# Altium schematic sheet ZYNQ_Power.SchDoc
size A3; DocumentNumber: 11; SheetNumber: 11; SheetTotal: 47
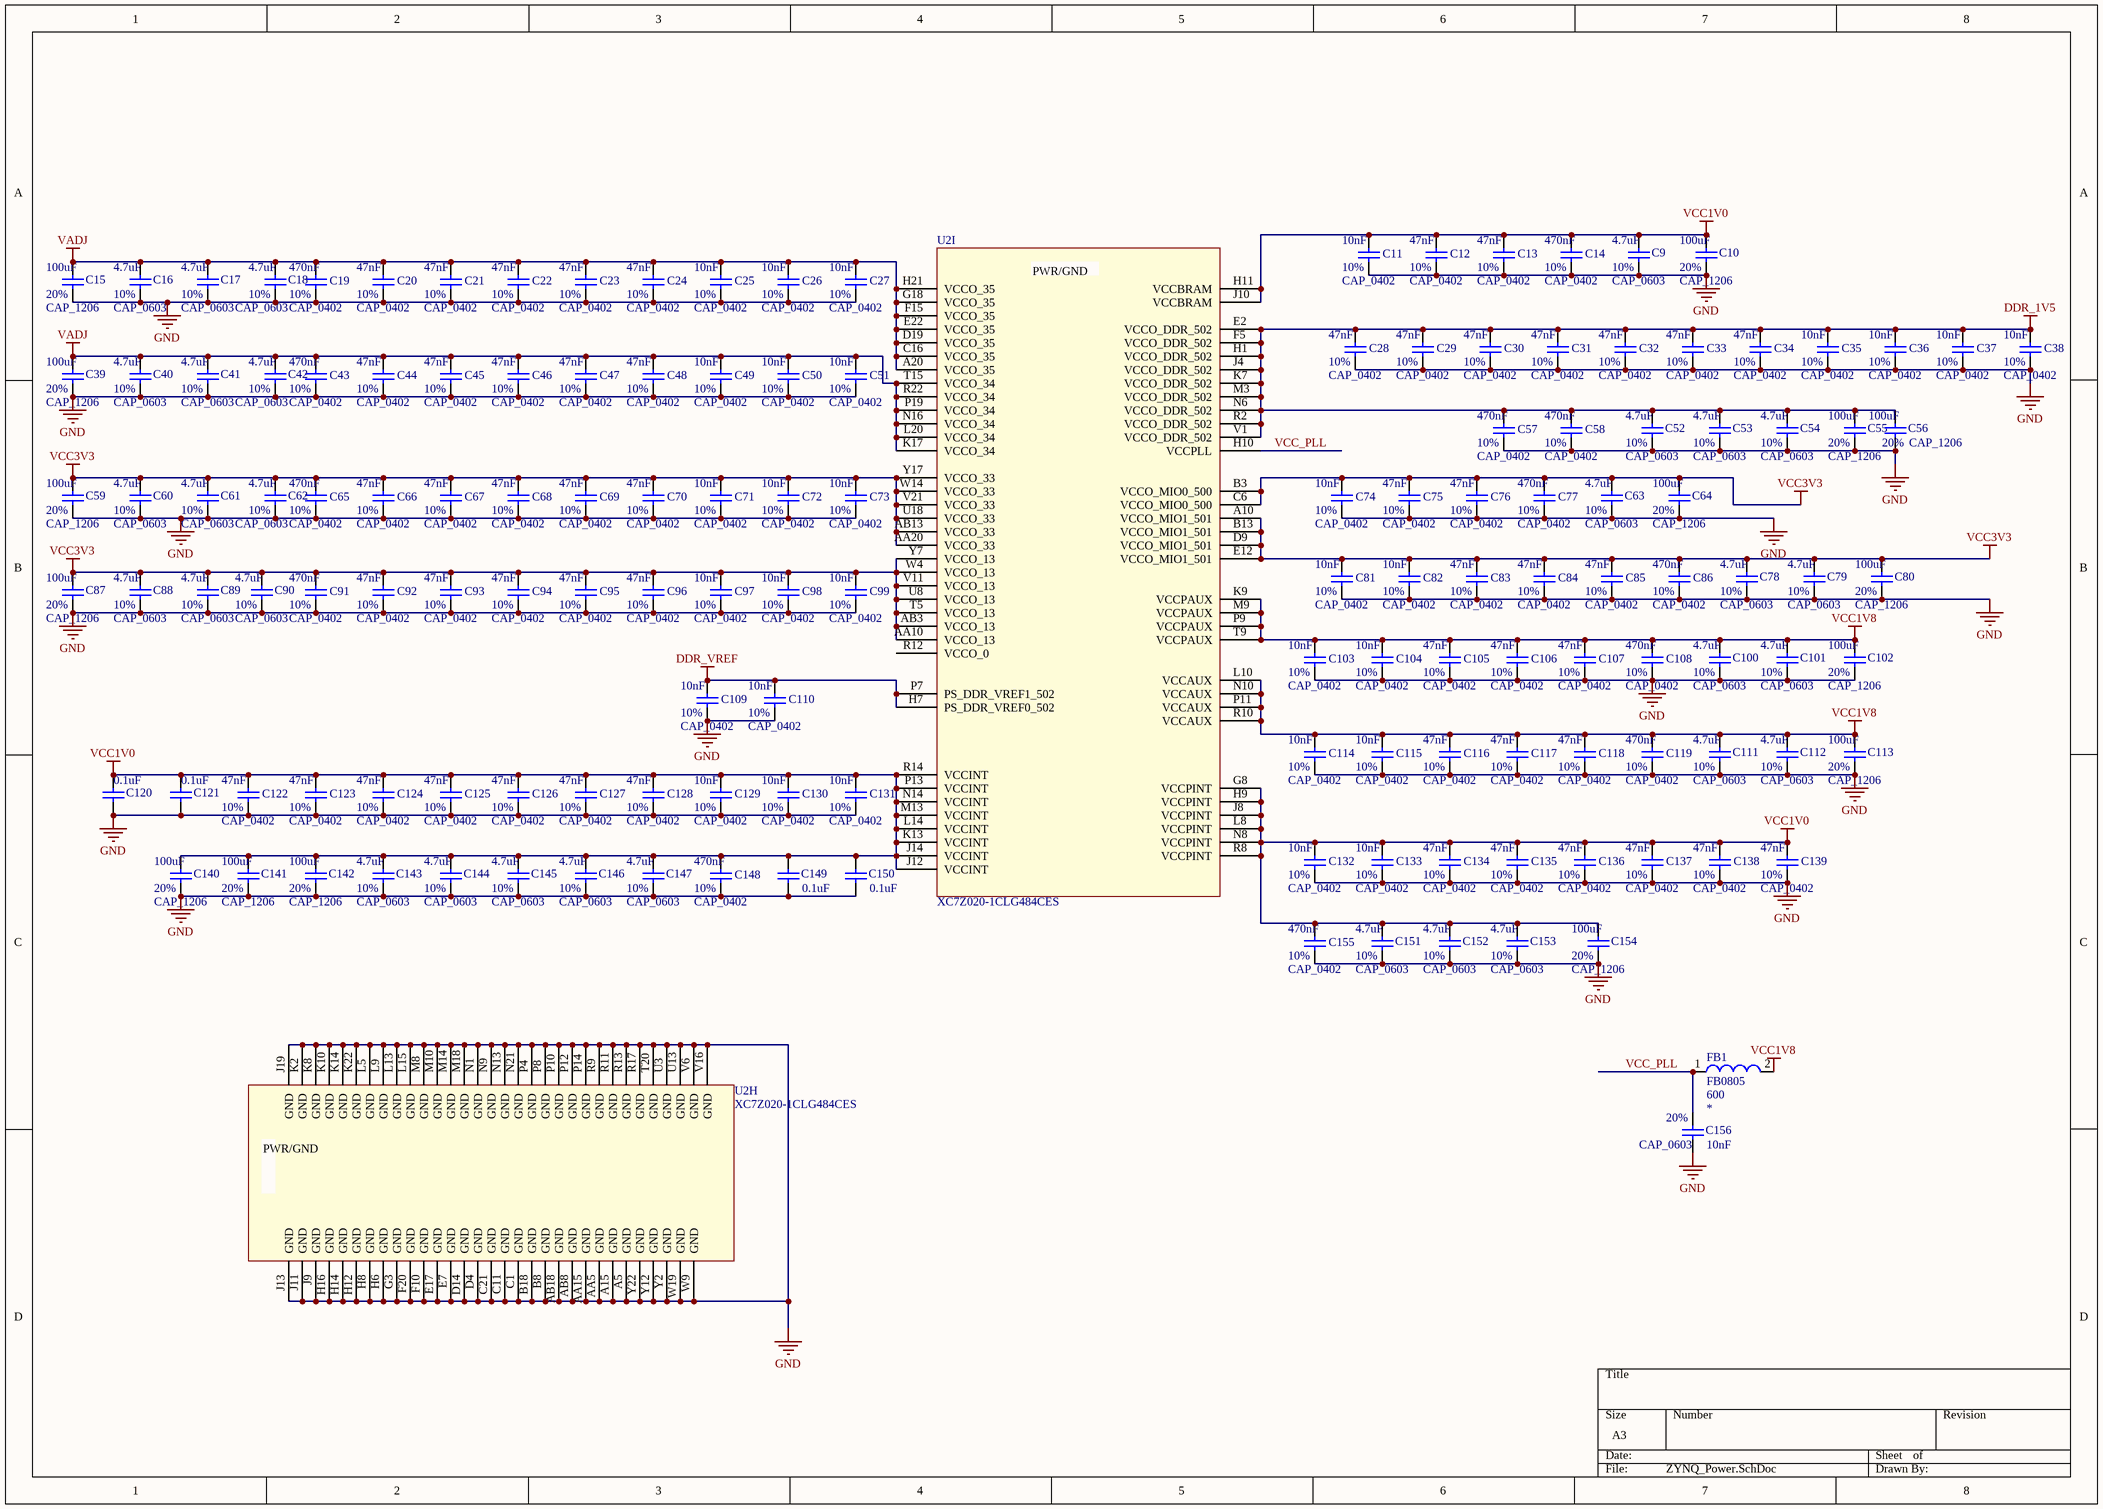
[diagram p0: ZYNQ_Power.SchDoc]

## Parts
C9  CAP_0603  value 4.7uF  Tolerance: 10%  [CAPC0603(1608)100_N]
C10  CAP_1206  value 100uF  Tolerance: 20%  [CAPC1206(3216)100_N]
C11  CAP_0402  value 10nF  Tolerance: 10%  [CAPC0402(1005)60_N]
C12  CAP_0402  value 47nF  Tolerance: 10%  [CAPC0402(1005)60_N]
C13  CAP_0402  value 47nF  Tolerance: 10%  [CAPC0402(1005)60_N]
C14  CAP_0402  value 470nF  Tolerance: 10%  [CAPC0402(1005)60_N]
C15  CAP_1206  value 100uF  Tolerance: 20%  [CAPC1206(3216)100_N]
C16  CAP_0603  value 4.7uF  Tolerance: 10%  [CAPC0603(1608)100_N]
C17  CAP_0603  value 4.7uF  Tolerance: 10%  [CAPC0603(1608)100_N]
C18  CAP_0603  value 4.7uF  Tolerance: 10%  [CAPC0603(1608)100_N]
C19  CAP_0402  value 470nF  Tolerance: 10%  [CAPC0402(1005)60_N]
C20  CAP_0402  value 47nF  Tolerance: 10%  [CAPC0402(1005)60_N]
C21  CAP_0402  value 47nF  Tolerance: 10%  [CAPC0402(1005)60_N]
C22  CAP_0402  value 47nF  Tolerance: 10%  [CAPC0402(1005)60_N]
C23  CAP_0402  value 47nF  Tolerance: 10%  [CAPC0402(1005)60_N]
C24  CAP_0402  value 47nF  Tolerance: 10%  [CAPC0402(1005)60_N]
C25  CAP_0402  value 10nF  Tolerance: 10%  [CAPC0402(1005)60_N]
C26  CAP_0402  value 10nF  Tolerance: 10%  [CAPC0402(1005)60_N]
C27  CAP_0402  value 10nF  Tolerance: 10%  [CAPC0402(1005)60_N]
C28  CAP_0402  value 47nF  Tolerance: 10%  [CAPC0402(1005)60_N]
C29  CAP_0402  value 47nF  Tolerance: 10%  [CAPC0402(1005)60_N]
C30  CAP_0402  value 47nF  Tolerance: 10%  [CAPC0402(1005)60_N]
C31  CAP_0402  value 47nF  Tolerance: 10%  [CAPC0402(1005)60_N]
C32  CAP_0402  value 47nF  Tolerance: 10%  [CAPC0402(1005)60_N]
C33  CAP_0402  value 47nF  Tolerance: 10%  [CAPC0402(1005)60_N]
C34  CAP_0402  value 47nF  Tolerance: 10%  [CAPC0402(1005)60_N]
C35  CAP_0402  value 10nF  Tolerance: 10%  [CAPC0402(1005)60_N]
C36  CAP_0402  value 10nF  Tolerance: 10%  [CAPC0402(1005)60_N]
C37  CAP_0402  value 10nF  Tolerance: 10%  [CAPC0402(1005)60_N]
C38  CAP_0402  value 10nF  Tolerance: 10%  [CAPC0402(1005)60_N]
C39  CAP_1206  value 100uF  Tolerance: 20%  [CAPC1206(3216)100_N]
C40  CAP_0603  value 4.7uF  Tolerance: 10%  [CAPC0603(1608)100_N]
C41  CAP_0603  value 4.7uF  Tolerance: 10%  [CAPC0603(1608)100_N]
C42  CAP_0603  value 4.7uF  Tolerance: 10%  [CAPC0603(1608)100_N]
C43  CAP_0402  value 470nF  Tolerance: 10%  [CAPC0402(1005)60_N]
C44  CAP_0402  value 47nF  Tolerance: 10%  [CAPC0402(1005)60_N]
C45  CAP_0402  value 47nF  Tolerance: 10%  [CAPC0402(1005)60_N]
C46  CAP_0402  value 47nF  Tolerance: 10%  [CAPC0402(1005)60_N]
C47  CAP_0402  value 47nF  Tolerance: 10%  [CAPC0402(1005)60_N]
C48  CAP_0402  value 47nF  Tolerance: 10%  [CAPC0402(1005)60_N]
C49  CAP_0402  value 10nF  Tolerance: 10%  [CAPC0402(1005)60_N]
C50  CAP_0402  value 10nF  Tolerance: 10%  [CAPC0402(1005)60_N]
C51  CAP_0402  value 10nF  Tolerance: 10%  [CAPC0402(1005)60_N]
C52  CAP_0603  value 4.7uF  Tolerance: 10%  [CAPC0603(1608)100_N]
C53  CAP_0603  value 4.7uF  Tolerance: 10%  [CAPC0603(1608)100_N]
C54  CAP_0603  value 4.7uF  Tolerance: 10%  [CAPC0603(1608)100_N]
C55  CAP_1206  value 100uF  Tolerance: 20%  [CAPC1206(3216)100_N]
C56  CAP_1206  value 100uF  Tolerance: 20%  [CAPC1206(3216)100_N]
C57  CAP_0402  value 470nF  Tolerance: 10%  [CAPC0402(1005)60_N]
C58  CAP_0402  value 470nF  Tolerance: 10%  [CAPC0402(1005)60_N]
C59  CAP_1206  value 100uF  Tolerance: 20%  [CAPC1206(3216)100_N]
C60  CAP_0603  value 4.7uF  Tolerance: 10%  [CAPC0603(1608)100_N]
C61  CAP_0603  value 4.7uF  Tolerance: 10%  [CAPC0603(1608)100_N]
C62  CAP_0603  value 4.7uF  Tolerance: 10%  [CAPC0603(1608)100_N]
C63  CAP_0603  value 4.7uF  Tolerance: 10%  [CAPC0603(1608)100_N]
C64  CAP_1206  value 100uF  Tolerance: 20%  [CAPC1206(3216)100_N]
C65  CAP_0402  value 470nF  Tolerance: 10%  [CAPC0402(1005)60_N]
C66  CAP_0402  value 47nF  Tolerance: 10%  [CAPC0402(1005)60_N]
C67  CAP_0402  value 47nF  Tolerance: 10%  [CAPC0402(1005)60_N]
C68  CAP_0402  value 47nF  Tolerance: 10%  [CAPC0402(1005)60_N]
C69  CAP_0402  value 47nF  Tolerance: 10%  [CAPC0402(1005)60_N]
C70  CAP_0402  value 47nF  Tolerance: 10%  [CAPC0402(1005)60_N]
C71  CAP_0402  value 10nF  Tolerance: 10%  [CAPC0402(1005)60_N]
C72  CAP_0402  value 10nF  Tolerance: 10%  [CAPC0402(1005)60_N]
C73  CAP_0402  value 10nF  Tolerance: 10%  [CAPC0402(1005)60_N]
C74  CAP_0402  value 10nF  Tolerance: 10%  [CAPC0402(1005)60_N]
C75  CAP_0402  value 47nF  Tolerance: 10%  [CAPC0402(1005)60_N]
C76  CAP_0402  value 47nF  Tolerance: 10%  [CAPC0402(1005)60_N]
C77  CAP_0402  value 470nF  Tolerance: 10%  [CAPC0402(1005)60_N]
C78  CAP_0603  value 4.7uF  Tolerance: 10%  [CAPC0603(1608)100_N]
C79  CAP_0603  value 4.7uF  Tolerance: 10%  [CAPC0603(1608)100_N]
C80  CAP_1206  value 100uF  Tolerance: 20%  [CAPC1206(3216)100_N]
C81  CAP_0402  value 10nF  Tolerance: 10%  [CAPC0402(1005)60_N]
C82  CAP_0402  value 10nF  Tolerance: 10%  [CAPC0402(1005)60_N]
C83  CAP_0402  value 47nF  Tolerance: 10%  [CAPC0402(1005)60_N]
C84  CAP_0402  value 47nF  Tolerance: 10%  [CAPC0402(1005)60_N]
C85  CAP_0402  value 47nF  Tolerance: 10%  [CAPC0402(1005)60_N]
C86  CAP_0402  value 470nF  Tolerance: 10%  [CAPC0402(1005)60_N]
C87  CAP_1206  value 100uF  Tolerance: 20%  [CAPC1206(3216)100_N]
C88  CAP_0603  value 4.7uF  Tolerance: 10%  [CAPC0603(1608)100_N]
C89  CAP_0603  value 4.7uF  Tolerance: 10%  [CAPC0603(1608)100_N]
C90  CAP_0603  value 4.7uF  Tolerance: 10%  [CAPC0603(1608)100_N]
C91  CAP_0402  value 470nF  Tolerance: 10%  [CAPC0402(1005)60_N]
C92  CAP_0402  value 47nF  Tolerance: 10%  [CAPC0402(1005)60_N]
C93  CAP_0402  value 47nF  Tolerance: 10%  [CAPC0402(1005)60_N]
C94  CAP_0402  value 47nF  Tolerance: 10%  [CAPC0402(1005)60_N]
C95  CAP_0402  value 47nF  Tolerance: 10%  [CAPC0402(1005)60_N]
C96  CAP_0402  value 47nF  Tolerance: 10%  [CAPC0402(1005)60_N]
C97  CAP_0402  value 10nF  Tolerance: 10%  [CAPC0402(1005)60_N]
C98  CAP_0402  value 10nF  Tolerance: 10%  [CAPC0402(1005)60_N]
C99  CAP_0402  value 10nF  Tolerance: 10%  [CAPC0402(1005)60_N]
C100  CAP_0603  value 4.7uF  Tolerance: 10%  [CAPC0603(1608)100_N]
C101  CAP_0603  value 4.7uF  Tolerance: 10%  [CAPC0603(1608)100_N]
C102  CAP_1206  value 100uF  Tolerance: 20%  [CAPC1206(3216)100_N]
C103  CAP_0402  value 10nF  Tolerance: 10%  [CAPC0402(1005)60_N]
C104  CAP_0402  value 10nF  Tolerance: 10%  [CAPC0402(1005)60_N]
C105  CAP_0402  value 47nF  Tolerance: 10%  [CAPC0402(1005)60_N]
C106  CAP_0402  value 47nF  Tolerance: 10%  [CAPC0402(1005)60_N]
C107  CAP_0402  value 47nF  Tolerance: 10%  [CAPC0402(1005)60_N]
C108  CAP_0402  value 470nF  Tolerance: 10%  [CAPC0402(1005)60_N]
C109  CAP_0402  value 10nF  Tolerance: 10%  [CAPC0402(1005)60_N]
C110  CAP_0402  value 10nF  Tolerance: 10%  [CAPC0402(1005)60_N]
C111  CAP_0603  value 4.7uF  Tolerance: 10%  [CAPC0603(1608)100_N]
C112  CAP_0603  value 4.7uF  Tolerance: 10%  [CAPC0603(1608)100_N]
C113  CAP_1206  value 100uF  Tolerance: 20%  [CAPC1206(3216)100_N]
C114  CAP_0402  value 10nF  Tolerance: 10%  [CAPC0402(1005)60_N]
C115  CAP_0402  value 10nF  Tolerance: 10%  [CAPC0402(1005)60_N]
C116  CAP_0402  value 47nF  Tolerance: 10%  [CAPC0402(1005)60_N]
C117  CAP_0402  value 47nF  Tolerance: 10%  [CAPC0402(1005)60_N]
C118  CAP_0402  value 47nF  Tolerance: 10%  [CAPC0402(1005)60_N]
C119  CAP_0402  value 470nF  Tolerance: 10%  [CAPC0402(1005)60_N]
C120  value 0.1uF  [CAPC0402(1005)60_N]  (hidden comment: TMK105BJ104KV-F)
C121  value 0.1uF  [CAPC0402(1005)60_N]  (hidden comment: TMK105BJ104KV-F)
C122  CAP_0402  value 47nF  Tolerance: 10%  [CAPC0402(1005)60_N]
C123  CAP_0402  value 47nF  Tolerance: 10%  [CAPC0402(1005)60_N]
C124  CAP_0402  value 47nF  Tolerance: 10%  [CAPC0402(1005)60_N]
C125  CAP_0402  value 47nF  Tolerance: 10%  [CAPC0402(1005)60_N]
C126  CAP_0402  value 47nF  Tolerance: 10%  [CAPC0402(1005)60_N]
C127  CAP_0402  value 47nF  Tolerance: 10%  [CAPC0402(1005)60_N]
C128  CAP_0402  value 47nF  Tolerance: 10%  [CAPC0402(1005)60_N]
C129  CAP_0402  value 10nF  Tolerance: 10%  [CAPC0402(1005)60_N]
C130  CAP_0402  value 10nF  Tolerance: 10%  [CAPC0402(1005)60_N]
C131  CAP_0402  value 10nF  Tolerance: 10%  [CAPC0402(1005)60_N]
C132  CAP_0402  value 10nF  Tolerance: 10%  [CAPC0402(1005)60_N]
C133  CAP_0402  value 10nF  Tolerance: 10%  [CAPC0402(1005)60_N]
C134  CAP_0402  value 47nF  Tolerance: 10%  [CAPC0402(1005)60_N]
C135  CAP_0402  value 47nF  Tolerance: 10%  [CAPC0402(1005)60_N]
C136  CAP_0402  value 47nF  Tolerance: 10%  [CAPC0402(1005)60_N]
C137  CAP_0402  value 47nF  Tolerance: 10%  [CAPC0402(1005)60_N]
C138  CAP_0402  value 47nF  Tolerance: 10%  [CAPC0402(1005)60_N]
C139  CAP_0402  value 47nF  Tolerance: 10%  [CAPC0402(1005)60_N]
C140  CAP_1206  value 100uF  Tolerance: 20%  [CAPC1206(3216)100_N]
C141  CAP_1206  value 100uF  Tolerance: 20%  [CAPC1206(3216)100_N]
C142  CAP_1206  value 100uF  Tolerance: 20%  [CAPC1206(3216)100_N]
C143  CAP_0603  value 4.7uF  Tolerance: 10%  [CAPC0603(1608)100_N]
C144  CAP_0603  value 4.7uF  Tolerance: 10%  [CAPC0603(1608)100_N]
C145  CAP_0603  value 4.7uF  Tolerance: 10%  [CAPC0603(1608)100_N]
C146  CAP_0603  value 4.7uF  Tolerance: 10%  [CAPC0603(1608)100_N]
C147  CAP_0603  value 4.7uF  Tolerance: 10%  [CAPC0603(1608)100_N]
C148  CAP_0402  value 470nF  Tolerance: 10%  [CAPC0402(1005)60_N]
C149  value 0.1uF  [CAPC0402(1005)60_N]  (hidden comment: TMK105BJ104KV-F)
C150  value 0.1uF  [CAPC0402(1005)60_N]  (hidden comment: TMK105BJ104KV-F)
C151  CAP_0603  value 4.7uF  Tolerance: 10%  [CAPC0603(1608)100_N]
C152  CAP_0603  value 4.7uF  Tolerance: 10%  [CAPC0603(1608)100_N]
C153  CAP_0603  value 4.7uF  Tolerance: 10%  [CAPC0603(1608)100_N]
C154  CAP_1206  value 100uF  Tolerance: 20%  [CAPC1206(3216)100_N]
C155  CAP_0402  value 470nF  Tolerance: 10%  [CAPC0402(1005)60_N]
C156  CAP_0603  value 10nF  Tolerance: 20%  [CAPC0402(1005)60_N]
FB1  FB0805  Resistance: 600  [Inductor0805(2012)]
U2  XC7Z020-1CLG484CES  [ZYNQ_xc7z020clg484pkg_BGA-484]  (parts H,I of 10)

## Nets
DDR_1V5: C28.2 C29.2 C30.2 C31.2 C32.2 C33.2 C34.2 C35.2 C36.2 C37.2 C38.2 C52.2 C53.2 C54.2 C55.2 C56.2 C57.2 C58.2 U2.E2(VCCO_DDR_502) U2.F5(VCCO_DDR_502) U2.H1(VCCO_DDR_502) U2.J4(VCCO_DDR_502) U2.K7(VCCO_DDR_502) U2.M3(VCCO_DDR_502) U2.N6(VCCO_DDR_502) U2.R2(VCCO_DDR_502) U2.V1(VCCO_DDR_502)
DDR_VREF: C109.2 C110.2 U2.H7(PS_DDR_VREF0_502) U2.P7(PS_DDR_VREF1_502)
GND: C9.1 C10.1 C11.1 C12.1 C13.1 C14.1 C15.1 C16.1 C17.1 C18.1 C19.1 C20.1 C21.1 C22.1 C23.1 C24.1 C25.1 C26.1 C27.1 C28.1 C29.1 C30.1 C31.1 C32.1 C33.1 C34.1 C35.1 C36.1 C37.1 C38.1 C39.1 C40.1 C41.1 C42.1 C43.1 C44.1 C45.1 C46.1 C47.1 C48.1 C49.1 C50.1 C51.1 C52.1 C53.1 C54.1 C55.1 C56.1 C57.1 C58.1 C59.1 C60.1 C61.1 C62.1 C63.1 C64.1 C65.1 C66.1 C67.1 C68.1 C69.1 C70.1 C71.1 C72.1 C73.1 C74.1 C75.1 C76.1 C77.1 C78.1 C79.1 C80.1 C81.1 C82.1 C83.1 C84.1 C85.1 C86.1 C87.1 C88.1 C89.1 C90.1 C91.1 C92.1 C93.1 C94.1 C95.1 C96.1 C97.1 C98.1 C99.1 C100.1 C101.1 C102.1 C103.1 C104.1 C105.1 C106.1 C107.1 C108.1 C109.1 C110.1 C111.1 C112.1 C113.1 C114.1 C115.1 C116.1 C117.1 C118.1 C119.1 C120.1 C121.1 C122.1 C123.1 C124.1 C125.1 C126.1 C127.1 C128.1 C129.1 C130.1 C131.1 C132.1 C133.1 C134.1 C135.1 C136.1 C137.1 C138.1 C139.1 C140.1 C141.1 C142.1 C143.1 C144.1 C145.1 C146.1 C147.1 C148.1 C149.1 C150.1 C151.1 C152.1 C153.1 C154.1 C155.1 C156.1 U2.A5(GND) U2.A15(GND) U2.AA5(GND) U2.AA15(GND) U2.AB8(GND) U2.AB18(GND) U2.B8(GND) U2.B18(GND) U2.C1(GND) U2.C11(GND) U2.C21(GND) U2.D4(GND) U2.D14(GND) U2.E7(GND) U2.E17(GND) U2.F10(GND) U2.F20(GND) U2.G3(GND) U2.H6(GND) U2.H8(GND) U2.H12(GND) U2.H14(GND) U2.H16(GND) U2.J9(GND) U2.J11(GND) U2.J13(GND) U2.J19(GND) U2.K2(GND) U2.K8(GND) U2.K10(GND) U2.K14(GND) U2.K22(GND) U2.L5(GND) U2.L9(GND) U2.L13(GND) U2.L15(GND) U2.M8(GND) U2.M10(GND) U2.M14(GND) U2.M18(GND) U2.N1(GND) U2.N9(GND) U2.N13(GND) U2.N21(GND) U2.P4(GND) U2.P8(GND) U2.P10(GND) U2.P12(GND) U2.P14(GND) U2.R9(GND) U2.R11(GND) U2.R13(GND) U2.R17(GND) U2.T20(GND) U2.U3(GND) U2.U13(GND) U2.V6(GND) U2.V16(GND) U2.W9(GND) U2.W19(GND) U2.Y2(GND) U2.Y12(GND) U2.Y22(GND)
VADJ: C15.2 C16.2 C17.2 C18.2 C19.2 C20.2 C21.2 C22.2 C23.2 C24.2 C25.2 C26.2 C27.2 C39.2 C40.2 C41.2 C42.2 C43.2 C44.2 C45.2 C46.2 C47.2 C48.2 C49.2 C50.2 C51.2 U2.A20(VCCO_35) U2.C16(VCCO_35) U2.D19(VCCO_35) U2.E22(VCCO_35) U2.F15(VCCO_35) U2.G18(VCCO_35) U2.H21(VCCO_35) U2.K17(VCCO_34) U2.L20(VCCO_34) U2.N16(VCCO_34) U2.P19(VCCO_34) U2.R22(VCCO_34) U2.T15(VCCO_34)
VCC1V0: C9.2 C10.2 C11.2 C12.2 C13.2 C14.2 C120.2 C121.2 C122.2 C123.2 C124.2 C125.2 C126.2 C127.2 C128.2 C129.2 C130.2 C131.2 C132.2 C133.2 C134.2 C135.2 C136.2 C137.2 C138.2 C139.2 C140.2 C141.2 C142.2 C143.2 C144.2 C145.2 C146.2 C147.2 C148.2 C149.2 C150.2 C151.2 C152.2 C153.2 C154.2 C155.2 U2.G8(VCCPINT) U2.H9(VCCPINT) U2.H11(VCCBRAM) U2.J8(VCCPINT) U2.J10(VCCBRAM) U2.J12(VCCINT) U2.J14(VCCINT) U2.K13(VCCINT) U2.L8(VCCPINT) U2.L14(VCCINT) U2.M13(VCCINT) U2.N8(VCCPINT) U2.N14(VCCINT) U2.P13(VCCINT) U2.R8(VCCPINT) U2.R14(VCCINT)
VCC1V8: C100.2 C101.2 C102.2 C103.2 C104.2 C105.2 C106.2 C107.2 C108.2 C111.2 C112.2 C113.2 C114.2 C115.2 C116.2 C117.2 C118.2 C119.2 FB1.2 U2.K9(VCCPAUX) U2.L10(VCCAUX) U2.M9(VCCPAUX) U2.N10(VCCAUX) U2.P9(VCCPAUX) U2.P11(VCCAUX) U2.R10(VCCAUX) U2.T9(VCCPAUX)
VCC3V3: C59.2 C60.2 C61.2 C62.2 C63.2 C64.2 C65.2 C66.2 C67.2 C68.2 C69.2 C70.2 C71.2 C72.2 C73.2 C74.2 C75.2 C76.2 C77.2 C78.2 C79.2 C80.2 C81.2 C82.2 C83.2 C84.2 C85.2 C86.2 C87.2 C88.2 C89.2 C90.2 C91.2 C92.2 C93.2 C94.2 C95.2 C96.2 C97.2 C98.2 C99.2 U2.A10(VCCO_MIO1_501) U2.AA10(VCCO_13) U2.AA20(VCCO_33) U2.AB3(VCCO_13) U2.AB13(VCCO_33) U2.B3(VCCO_MIO0_500) U2.B13(VCCO_MIO1_501) U2.C6(VCCO_MIO0_500) U2.D9(VCCO_MIO1_501) U2.E12(VCCO_MIO1_501) U2.T5(VCCO_13) U2.U8(VCCO_13) U2.U18(VCCO_33) U2.V11(VCCO_13) U2.V21(VCCO_33) U2.W4(VCCO_13) U2.W14(VCCO_33) U2.Y7(VCCO_13) U2.Y17(VCCO_33)
VCC_PLL: C156.2 FB1.1 U2.H10(VCCPLL)

Not connected (* = marked no-connect by the designer): U2 R12(VCCO_0)

## Notes on the sheet
- (in symbol XC7Z020-1CLG484CES, part H) PWR/GND
- (in symbol XC7Z020-1CLG484CES, part I) PWR/GND

## Library data of the parts
C9 C16-C18 C40-C42 C52-C54 C60-C63 C78 C79 C88-C90 C100 C101 C111 C112 C143-C147 C151-C153 = CAP_0603: 4.7uF, ceramic, 10% 6.3V X5R Low ESR, 0603; Part Number: GRM188R60J475KE19D; Manufacturer: Murata Electronics North America; Footprint Ref: CAPC0603(1608)100_N; Library Ref: CAP_0603
C10 C15 C39 C55 C56 C59 C64 C80 C87 C102 C113 C140-C142 C154 = CAP_1206: CAP CER 100UF 6.3V 20% X5R 1206; Part Number: JMK316BJ107ML-T; Manufacturer: Taiyo Yuden; Footprint Ref: CAPC1206(3216)100_N; Library Ref: CAP_1206; Distributor: http://www.yuden.co.jp/productdata/catalog/en/mlcc01_e.pdf
C11 C25-C27 C35-C38 C49-C51 C71-C74 C81 C82 C97-C99 C103 C104 C109 C110 C114 C115 C129-C133 = CAP_0402: 10000pF, ceramic, 10% 6.3V X5R, 0402; Part Number: GRM155R60J103KA01D; Manufacturer: Murata Electronics North America; Footprint Ref: CAPC0402(1005)60_N; Library Ref: CAP_0402
C12 C13 C20-C24 C28-C34 C44-C48 C66-C70 C75 C76 C83-C85 C92-C96 C105-C107 C116-C118 C122-C128 C134-C139 = CAP_0402: 0.047uF, ceramic, 10% 6.3V X5R, 0402; Part Number: GRM155R60J473KA01D; Manufacturer: Murata Electronics North America; Footprint Ref: CAPC0402(1005)60_N; Library Ref: CAP_0402
C14 C19 C43 C57 C58 C65 C77 C86 C91 C108 C119 C148 C155 = CAP_0402: 0.47uF, ceramic, 10% 6.3V X5R, 0402; Part Number: GRM155R60J474KE19D; Manufacturer: Murata Electronics North America; Footprint Ref: CAPC0402(1005)60_N; Library Ref: CAP_0402
C120 C121 C149 C150 = TMK105BJ104KV-F: 0.1uF, ceramic, 10%, 25V, X5R, 0402; Manufacturer: Taiyo Yuden; Tolerance: 10%; Part Number: TMK105BJ104KV-F
C156 = CAP_0603: 10000pF, ceramic, 10% 6.3V X5R, 0402; Part Number: GRM155R60J103KA01D; Manufacturer: Murata Electronics North America; Footprint Ref: CAPC0402(1005)60_N; Library Ref: CAP_0402
FB1 = FerriteBead0805: MPZ2012S601A, 600 ohm, 100MHz, 0805; Manufacturer: TDK Corporation; Value: 600; Max_Current: *; Part Number: MPZ2012S601A; Footprint Ref: Inductor0805(2012); Library Ref: FerriteBead0805
U2 = XC7Z020-1CLG484CES: XC7Z020-1CLG484CES, Zynq-7000 All Programmable SoC; Manufacturer: Xilinx; Part Number: XC7Z020-1CLG484CES